# EAGLE design VFD-Power (EAGLE 9.5.1)
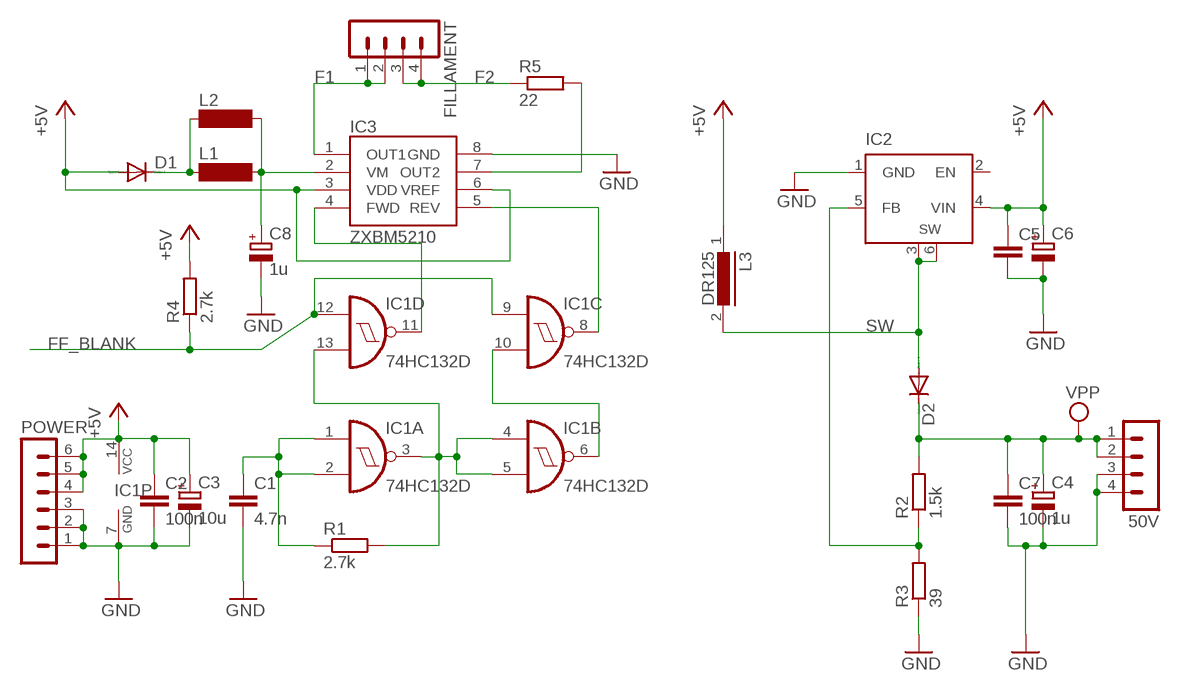
[diagram p0: schematic, sheet 1]

## Parts
50V  MA04-1  [MA04-1]
C1  4.7n  C-EUC1206  [C1206]
C2  100n  C-EUC1206  [C1206]
C3  10u  CPOL-EU153CLV-0807  [153CLV-0807]
C4  1u  CPOL-EU153CLV-0505  [153CLV-0505]
C5  C-EUC1206  [C1206]
C6  CPOL-EU153CLV-0807  [153CLV-0807]
C7  100n  C-EUC1206  [C1206]
C8  1u  CPOL-EU153CLV-0505  [153CLV-0505]
D1  DIODE-SMB  [SMB]
D2  DIODE-SMB  [SMB]
FILLAMENT  MA04-1  [MA04-1]
IC1  74HC132D  [SO14]
IC2  XL6009  [TO263-5]
IC3  ZXBM5210  [SO8]
L1  SM-NE45  [SM-NE45]
L2  MS85  [MS85]
L3  DR125  [DR125]
POWER  MA06-1  [MA06-1]
R1  2.7k  R-EU_R1206  [R1206]
R2  1.5k  R-EU_R1206  [R1206]
R3  39  R-EU_R1206  [R1206]
R4  2.7k  R-EU_R1206  [R1206]
R5  22  R-EU_0411/15  [0411/15]

## Nets
+5V [+5V]: C2.1 C3.+ C5.1 C6.+ D1.A IC1.14(P:VCC) IC2.4(VIN) IC3.3(VDD) IC3.6(VREF) L3.1 POWER.4 POWER.5 POWER.6 R4.2
F1 [w24]: FILLAMENT.1 FILLAMENT.2 IC3.1(OUT1)
F2 [w24]: FILLAMENT.3 FILLAMENT.4 R5.1
FF_BLANK: IC1.9(C:I0) IC1.12(D:I0) R4.1
GND: 50V.3 50V.4 C1.2 C2.2 C3.- C4.- C5.2 C6.- C7.2 C8.- IC1.7(P:GND) IC2.1(GND) IC3.8(GND) POWER.1 POWER.2 POWER.3 R3.1
N$1: IC1.6(B:O) IC1.10(C:I1)
N$2: C1.1 IC1.1(A:I0) IC1.2(A:I1) R1.1
N$3: IC1.11(D:O) IC3.4(FWD)
N$4 [w24]: IC3.7(OUT2) R5.2
N$6: IC1.8(C:O) IC3.5(REV)
N$7 [w24]: D1.C L1.1 L2.1
N$8 [w24]: C8.+ IC3.2(VM) L1.2 L2.2
N$9: IC1.3(A:O) IC1.4(B:I0) IC1.5(B:I1) IC1.13(D:I1) R1.2
N$14: IC2.5(FB) R2.1 R3.2
SW [+5V]: D2.A IC2.3(SW) IC2.6(SW) L3.2
VPP: 50V.1 50V.2 C4.+ C7.1 D2.C R2.2
Unconnected: IC2.2(EN)

## Library data of the parts
50V FILLAMENT = con-lstb:MA04-1: PIN HEADER; OC_FARNELL: unknown; OC_NEWARK: unknown
C1 C2 C5 C7 = rcl:C-EU: CAPACITOR, European symbol; SPICEPREFIX: C
C3 C4 C6 C8 = rcl:CPOL-EU: POLARIZED CAPACITOR, European symbol; SPICEPREFIX: C
D1 D2 = diode:DIODE-: DIODE
IC1 = 74xx-eu:74*132: Quad 2-input NAND schmitt trigger
IC2 = vfds:XL6009: STEP-DOWN VOLTAGE REGULATOR
IC3 = vfds:ZXBM5210: H-Bridge motor driver.; PARTNAME: ZXBM5210
L1 = inductor-neosid:SM-NE45: INDUCTOR SMD chip inductor; OC_FARNELL: unknown; OC_NEWARK: unknown
L2 = inductor-neosid:MS85: INDUCTOR SMD power inductor; OC_FARNELL: unknown; OC_NEWARK: unknown
L3 = inductors:DR125: High Power Density, High Efficiency, Shielded Inductors Source: coiltronics_dr_series.pdf; SPICEPREFIX: L
POWER = con-lstb:MA06-1: PIN HEADER; OC_FARNELL: unknown; OC_NEWARK: unknown
R1-R5 = rcl:R-EU_: RESISTOR, European symbol; SPICEPREFIX: R

## Net classes
1 +5V: width 0.813 mm, clearance 0.508 mm
2 w24: width 0.61 mm

## Board
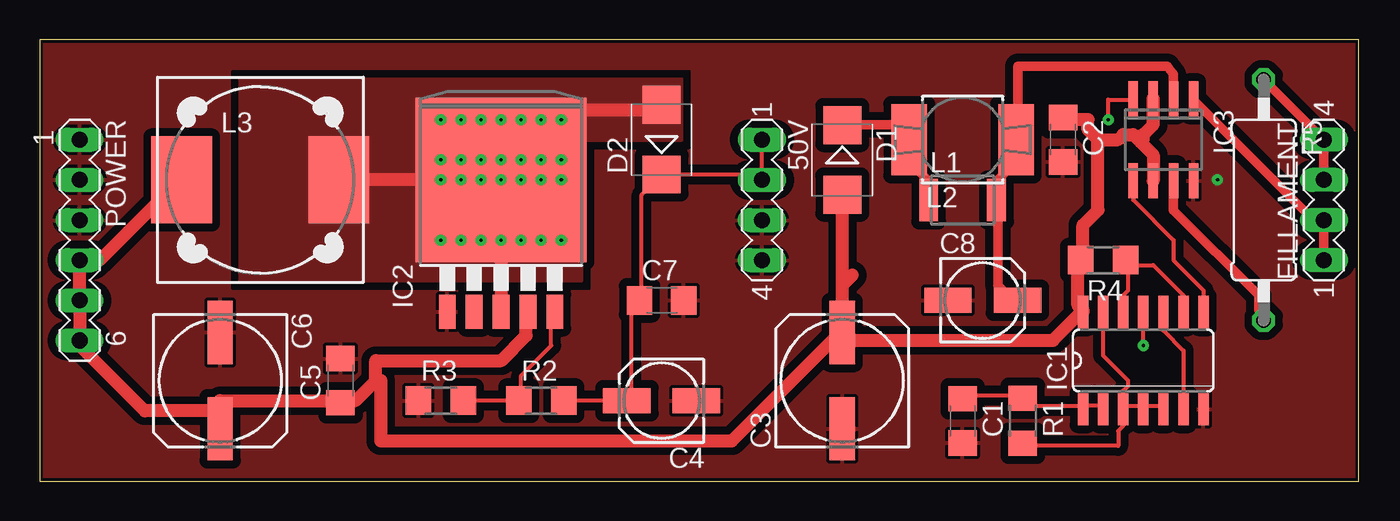
[diagram p1: board, top side]
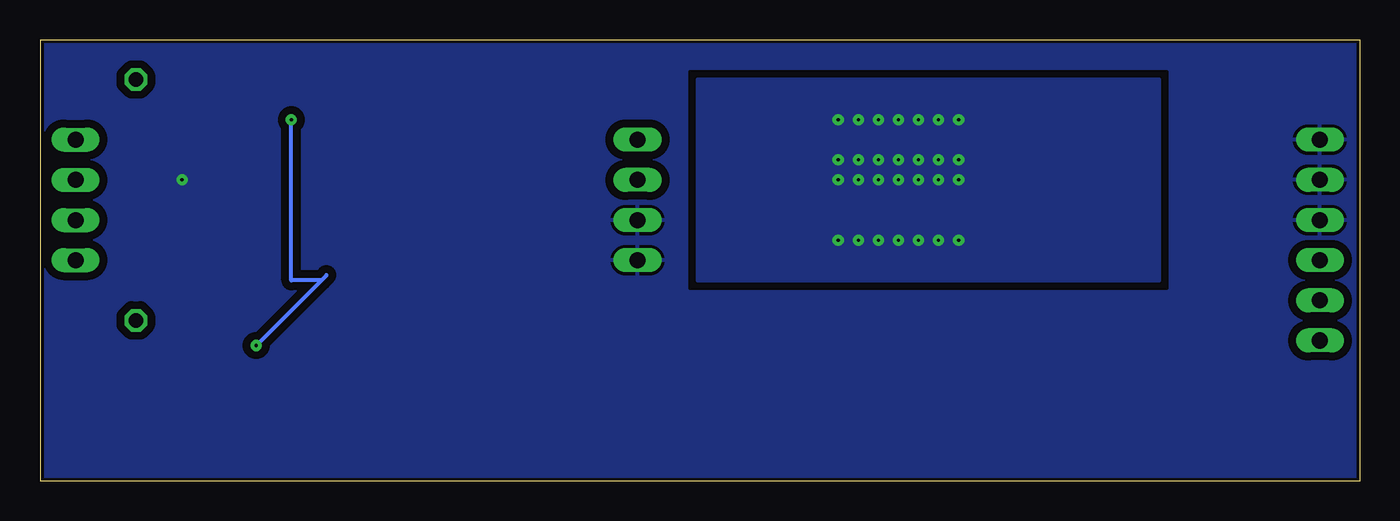
[diagram p2: board, bottom side, seen from below]

Size 83.49 x 27.93 mm. Coordinates in mm from the lower left corner, seen from the top.
Outline: 0,0 83.49,0 83.49,27.93 0,27.93 0,0
Copper layers (1*16): Top 0.07mm / dielectric 1.5mm / Bottom 0.07mm
Design rules "Multi-CB_2L_250um-Tracks_OL105um *": minimum track width 0.25mm, minimum drill 0.2mm, track to track 0.5mm, track to pad 0.5mm, pad to pad 0.5mm, via to via 0.5mm, smd to smd 0mil, copper to edge 0.2mm, drill to drill 0.2mm, minimum pad ring 0.25mm, minimum via ring 0.25mm, stop-mask expansion 2mil, vias tented up to drill 0.45mm, thermal gap 0.2mm

### Footprints (pad centres in the part's own frame; a part is rotated, then mirrored left to right if it is on the bottom)
MA04-1 = drill 1.016 long: 1 -3.81,0; 2 -1.27,0; 3 1.27,0; 4 3.81,0
C1206 = smd 1.6 x 1.8: 1 -1.4,0; 2 1.4,0
153CLV-0807 = smd 4 x 1.6: + 3.05,0; - -3.05,0
153CLV-0505 = smd 3 x 1.6: + 2.2,0; - -2.2,0
SMB = smd 2.4 x 2.4: A 2.2,0; C -2.2,0
SO14 = smd 0.66 x 2.032: 1 -3.81,-3.073; 2 -2.54,-3.073; 3 -1.27,-3.073; 4 0,-3.073; 5 1.27,-3.073; 6 2.54,-3.073; 7 3.81,-3.073; 8 3.81,3.073; 9 2.54,3.073; 10 1.27,3.073; 11 0,3.073; 12 -1.27,3.073; 13 -2.54,3.073; 14 -3.81,3.073
TO263-5 = smd 1.067 x 2.159: 1 -3.404,-5.791; 2 -1.702,-5.791; 3 0,-5.791; 4 1.702,-5.791; 5 3.404,-5.791 | smd 10.8 x 10.41: 6 0,2.54
SO8 = smd 0.6 x 2.2: 1 -1.905,-2.6; 2 -0.635,-2.6; 3 0.635,-2.6; 4 1.905,-2.6; 5 1.905,2.6; 6 0.635,2.6; 7 -0.635,2.6; 8 -1.905,2.6
SM-NE45 = smd 1.2 x 2.7: 1 -2.15,0; 2 2.15,0
MS85 = smd 4.5 x 2.25: 1 0,-3.383; 2 0,3.383
DR125 = smd 3.85 x 5.5: 1 -4.975,0; 2 4.975,0
MA06-1 = drill 1.016 long: 1 -6.35,0; 2 -3.81,0; 3 -1.27,0; 4 1.27,0; 5 3.81,0; 6 6.35,0
R1206 = smd 1.6 x 1.803: 1 -1.422,0; 2 1.422,0
0411/15 = drill 0.914 octagon: 1 -7.62,0; 2 7.62,0

### Placement (x,y rotation side)
50V  45.72,17.78 270 top
C1  58.42,3.81 270 top
C2  64.77,21.59 270 top
C3  50.8,6.35 90 top
C4  39.37,5.08 180 top
C5  19.05,6.35 90 top
C6  11.43,6.35 270 top
C7  39.37,11.43 0 top
C8  59.69,11.43 0 top
D1  50.8,20.32 270 top
D2  39.37,21.59 90 top
FILLAMENT  81.28,17.78 90 top
IC1  69.85,7.62 0 top
IC2  29.21,16.51 0 top
IC3  71.12,21.59 180 top
L1  58.42,17.78 0 top
L2  58.42,21.59 270 top
L3  13.97,19.05 0 top
POWER  2.54,15.24 270 top
R1  62.23,3.81 270 top
R2  31.75,5.08 0 top
R3  25.4,5.08 0 top
R4  67.31,13.97 180 top
R5  77.47,17.78 270 top

### Tracks (layer width: path | path; a pad name or v marks a point on that pad's centre or on a via)
+5V
  Top 0.813: R4.2 65.72,13.97 65.72,11.11 66.04,10.79 IC1.14 65.72,10.48 64.14,8.89 51.12,8.89 51.12,9.21 C3.+ | 50.8,12.38 51.44,13.02 | C3.+ 50.8,12.38 | 66.04,14.29 R4.2 | 21.27,6.35 21.27,7.62 29.21,7.62 30.8,9.21 30.8,10.48 IC2.4 | 21.27,6.35 20,5.08 19.37,5.08 C5.1 19.05,5.08 11.43,5.08 C6.+ 11.11,4.45 6.67,4.45 2.54,8.57 POWER.6 POWER.5 POWER.4 3.81,13.97 8.89,19.05 L3.1 | C3.+ 50.48,9.21 43.81,2.54 21.59,2.54 21.59,6.35 21.27,6.35 | 66.99,21.59 66.36,22.23 66.36,22.86 64.77,22.86 C2.1 | 66.99,21.59 66.99,17.14 66.04,16.19 66.04,14.61 R4.2 | IC3.6 70.48,20.64 69.69,21.43 | 69.69,21.43 69.22,21.91 68.58,21.91 68.26,21.59 66.99,21.59 | IC3.3 70.48,22.54 69.85,21.91 69.85,21.59 69.69,21.43 | 50.8,12.38 D1.A
F1
  Top 0.61: 80.8,16.35 81.28,15.88 FILLAMENT.1 | 80.8,16.35 73.03,24.13 IC3.1 | FILLAMENT.2 80.96,16.51 80.8,16.35
F2
  Top 0.61: R5.1 FILLAMENT.4 FILLAMENT.3
FF_BLANK
  Top 0.25: 68.9,13.65 68.9,12.06 68.58,11.75 IC1.12 | 68.9,13.65 68.9,13.97 R4.1 68.9,13.65 | IC1.9 72.39,11.75 70.48,13.65 68.9,13.65
GND  (via drill 0.2)
  other vias: 74.55,19.05
  pour Bottom (rank 6): -2.54,31.75 -2.54,-3.81 83.82,-3.81 83.82,31.75
  pour Top (rank 6): -1.27,30.48 85.09,30.48 85.09,-2.54 -1.27,-2.54
N$1
  Top 0.25: IC1.6 72.39,8.26 71.12,9.53 IC1.10
N$2
  Top 0.25: 66.04,4.76 67.31,4.76 IC1.2 | C1.1 58.42,5.4 62.23,5.4 R1.1 62.23,4.76 66.04,4.76 | 66.04,4.76 IC1.1
N$3  (via drill 0.2)
  Top 0.25: v69.85,8.57 IC1.11 | v67.63,22.86 67.63,24.13 69.22,24.13 IC3.4
  Bottom 0.25: 65.41,13.02 65.72,12.7 | 65.72,12.7 v69.85,8.57 | v67.63,22.86 67.63,12.7 65.72,12.7
N$4
  Top 0.61: IC3.7 71.75,17.14 77.15,11.75 77.15,10.79 77.47,10.48 R5.2
N$6
  Top 0.25: IC1.8 73.66,12.06 71.75,13.97 71.75,15.24 69.22,17.78 IC3.5
N$7
  Top 0.61: D1.C 50.8,22.54 54.93,22.54 54.93,21.59 L2.1 55.24,21.59 55.24,20 56.2,19.05 56.2,17.78 L1.1
N$8
  Top 0.25: 61.91,11.43 C8.+
  Top 0.61: IC3.2 71.75,25.72 71.37,26.23 61.91,26.23 61.91,21.59 L2.2 61.59,21.59 61.59,20 60.64,19.05 60.64,17.78 | 60.64,17.78 60.64,12.38 61.59,11.43 C8.+ | 60.64,17.78 L1.2
N$9
  Top 0.25: R1.2 62.23,2.22 68.26,2.22 68.26,3.17 68.58,3.49 IC1.3 68.58,4.76 | 68.58,4.76 69.85,4.76 | 69.85,4.76 71.12,4.76 IC1.5 | 69.85,4.76 IC1.4 | IC1.13 67.31,7.94 68.9,6.35 68.9,6.03 68.58,5.71 68.58,4.76
N$14
  Top 0.25: R3.2 R2.1 30.48,5.08 30.48,6.67 32.38,8.57 32.38,10.48 IC2.5
SW  (via drill 0.2)
  Top 0.813: IC2.6 IC2.3 | IC2.6 29.21,23.5 39.37,23.5 D2.A | IC2.6 v25.4,19.05 L3.2
  other vias: 26.67,19.05 27.94,19.05 29.21,19.05 30.48,19.05 31.75,19.05 33.02,19.05 33.02,20.32 31.75,20.32 30.48,20.32 29.21,20.32 27.94,20.32 26.67,20.32 25.4,20.32 25.4,15.24 26.67,15.24 27.94,15.24 29.21,15.24 30.48,15.24 31.75,15.24 33.02,15.24 33.02,22.86 31.75,22.86 30.48,22.86 29.21,22.86 27.94,22.86 26.67,22.86 25.4,22.86
  pour Bottom (no thermals): 12.7,25.4 41.91,25.4 41.91,12.7 12.7,12.7
  pour Top (no thermals): 12.7,25.4 12.7,12.7 34.29,12.7 34.29,21.59 40.64,21.59 40.64,25.4
VPP
  Top 0.25: 45.72,19.37 39.37,19.37 | 45.72,19.37 50V.1 | 45.72,19.37 50V.2 | R2.2 C4.+ 37.47,5.08 37.47,11.11 37.78,11.43 C7.1 38.1,11.43 38.1,18.1 39.37,19.37 | 39.37,19.37 D2.C